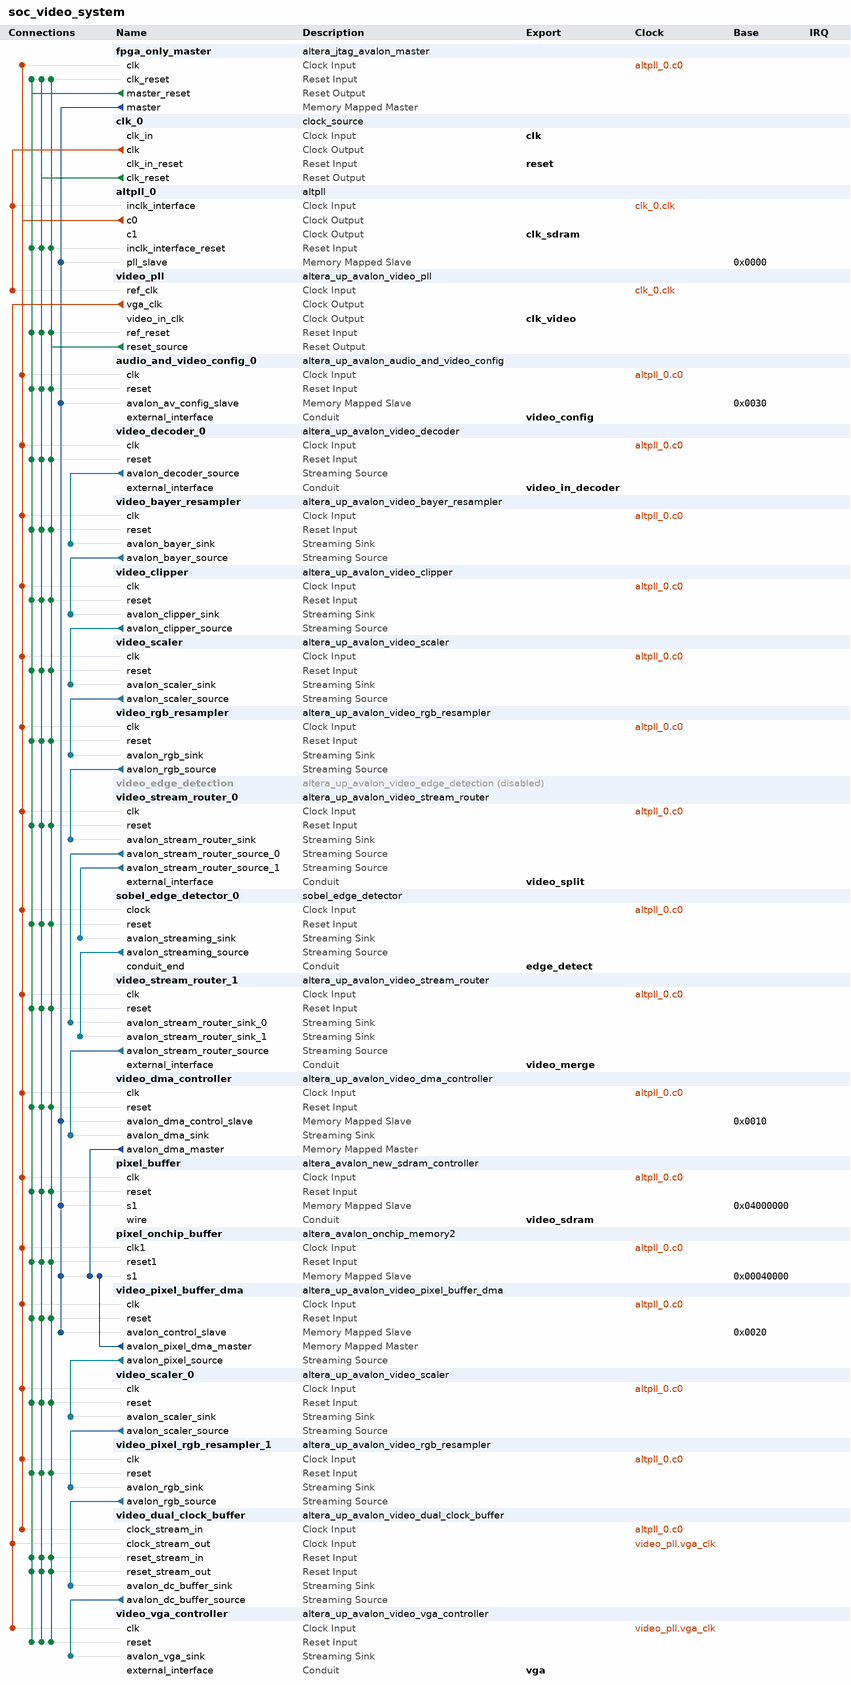
[diagram p0: system contents]
# Platform Designer (Qsys) system soc_video_system, MAX 10 10M50DAF484C6GES
# Parameters at their usual value, and those the tool derives, are not listed.
package require -exact qsys 17.1
create_system soc_video_system
set_project_property DEVICE_FAMILY {MAX 10}
set_project_property DEVICE 10M50DAF484C6GES

add_instance fpga_only_master altera_jtag_avalon_master 17.1

add_instance clk_0 clock_source 17.1
set_instance_parameter_value clk_0 clockFrequency 50000000

add_instance altpll_0 altpll 17.1
set_instance_parameter_value altpll_0 CLK0_DIVIDE_BY 1
set_instance_parameter_value altpll_0 CLK0_MULTIPLY_BY 2
set_instance_parameter_value altpll_0 CLK1_DIVIDE_BY 1
set_instance_parameter_value altpll_0 CLK1_DUTY_CYCLE 50
set_instance_parameter_value altpll_0 CLK1_MULTIPLY_BY 2
set_instance_parameter_value altpll_0 CLK1_PHASE_SHIFT -5139
set_instance_parameter_value altpll_0 INCLK0_INPUT_FREQUENCY 20000
set_instance_parameter_value altpll_0 PORT_ARESET PORT_UNUSED
set_instance_parameter_value altpll_0 PORT_LOCKED PORT_UNUSED
set_instance_parameter_value altpll_0 PORT_clk1 PORT_USED
set_instance_parameter_value altpll_0 PORT_clk2 PORT_UNUSED
set_instance_parameter_value altpll_0 PORT_clk3 PORT_UNUSED

add_instance video_pll altera_up_avalon_video_pll 17.1
set_instance_parameter_value video_pll camera {5MP Digital Camera (THDB_D5M)}
set_instance_parameter_value video_pll gui_refclk 50.0
set_instance_parameter_value video_pll lcd {2.4" LCD on LT24}
set_instance_parameter_value video_pll video_in_clk_en true

add_instance audio_and_video_config_0 altera_up_avalon_audio_and_video_config 17.1
set_instance_parameter_value audio_and_video_config_0 audio_in {Microphone to ADC}
set_instance_parameter_value audio_and_video_config_0 bit_length 24
set_instance_parameter_value audio_and_video_config_0 board DE1-SoC
set_instance_parameter_value audio_and_video_config_0 line_in_bypass false
set_instance_parameter_value audio_and_video_config_0 sampling_rate {48 kHz}

add_instance video_decoder_0 altera_up_avalon_video_decoder 17.1
set_instance_parameter_value video_decoder_0 video_source {5MP Digital Camera (THDB_D5M)}

add_instance video_bayer_resampler altera_up_avalon_video_bayer_resampler 17.1
set_instance_parameter_value video_bayer_resampler custom_height_in 1944
set_instance_parameter_value video_bayer_resampler custom_width_in 2592
set_instance_parameter_value video_bayer_resampler use_custom_format true

add_instance video_clipper altera_up_avalon_video_clipper 17.1
set_instance_parameter_value video_clipper color_bits 8
set_instance_parameter_value video_clipper color_planes 3
set_instance_parameter_value video_clipper drop_bottom 6
set_instance_parameter_value video_clipper drop_left 8
set_instance_parameter_value video_clipper drop_right 8
set_instance_parameter_value video_clipper drop_top 6
set_instance_parameter_value video_clipper height_in 972
set_instance_parameter_value video_clipper width_in 1296

add_instance video_scaler altera_up_avalon_video_scaler 17.1
set_instance_parameter_value video_scaler color_bits 8
set_instance_parameter_value video_scaler color_planes 3
set_instance_parameter_value video_scaler height_in 960
set_instance_parameter_value video_scaler height_scaling 0.25
set_instance_parameter_value video_scaler width_in 1280
set_instance_parameter_value video_scaler width_scaling 0.25

add_instance video_rgb_resampler altera_up_avalon_video_rgb_resampler 17.1
set_instance_parameter_value video_rgb_resampler alpha 1023
set_instance_parameter_value video_rgb_resampler input_type {24-bit RGB}
set_instance_parameter_value video_rgb_resampler output_type {8-bit Grayscale}

add_instance video_edge_detection altera_up_avalon_video_edge_detection 17.1
set_instance_property video_edge_detection ENABLED false
set_instance_parameter_value video_edge_detection intensity 1
set_instance_parameter_value video_edge_detection width 320

add_instance video_stream_router_0 altera_up_avalon_video_stream_router 17.1
set_instance_parameter_value video_stream_router_0 color_bits 8
set_instance_parameter_value video_stream_router_0 color_planes 1
set_instance_parameter_value video_stream_router_0 router_type Split
set_instance_parameter_value video_stream_router_0 sync false

add_instance sobel_edge_detector_0 sobel_edge_detector 1.0
set_instance_parameter_value sobel_edge_detector_0 WIDTH 320

add_instance video_stream_router_1 altera_up_avalon_video_stream_router 17.1
set_instance_parameter_value video_stream_router_1 color_bits 8
set_instance_parameter_value video_stream_router_1 color_planes 1
set_instance_parameter_value video_stream_router_1 router_type Merge
set_instance_parameter_value video_stream_router_1 sync false

add_instance video_dma_controller altera_up_avalon_video_dma_controller 17.1
set_instance_parameter_value video_dma_controller addr_mode X-Y
set_instance_parameter_value video_dma_controller back_start_address 0
set_instance_parameter_value video_dma_controller color_bits 8
set_instance_parameter_value video_dma_controller color_planes 1
set_instance_parameter_value video_dma_controller dma_enabled true
set_instance_parameter_value video_dma_controller height 240
set_instance_parameter_value video_dma_controller mode {From Stream to Memory}
set_instance_parameter_value video_dma_controller start_address 0
set_instance_parameter_value video_dma_controller width 320

add_instance pixel_buffer altera_avalon_new_sdram_controller 17.1
set_instance_parameter_value pixel_buffer TAC 5.4
set_instance_parameter_value pixel_buffer TRCD 15.0
set_instance_parameter_value pixel_buffer TRFC 75.0
set_instance_parameter_value pixel_buffer TRP 15.0
set_instance_parameter_value pixel_buffer TWR 20.0
set_instance_parameter_value pixel_buffer casLatency 3
set_instance_parameter_value pixel_buffer columnWidth 10
set_instance_parameter_value pixel_buffer dataWidth 16
set_instance_parameter_value pixel_buffer generateSimulationModel false
set_instance_parameter_value pixel_buffer model single_Micron_MT48LC4M32B2_7_chip
set_instance_parameter_value pixel_buffer numberOfBanks 4
set_instance_parameter_value pixel_buffer numberOfChipSelects 1
set_instance_parameter_value pixel_buffer powerUpDelay 100.0
set_instance_parameter_value pixel_buffer refreshPeriod 57.0
set_instance_parameter_value pixel_buffer rowWidth 13

add_instance pixel_onchip_buffer altera_avalon_onchip_memory2 17.1
set_instance_parameter_value pixel_onchip_buffer dataWidth 8
set_instance_parameter_value pixel_onchip_buffer dualPort false
set_instance_parameter_value pixel_onchip_buffer initMemContent false
set_instance_parameter_value pixel_onchip_buffer initializationFileName onchip_mem.hex
set_instance_parameter_value pixel_onchip_buffer memorySize 153600
set_instance_parameter_value pixel_onchip_buffer resetrequest_enabled false

add_instance video_pixel_buffer_dma altera_up_avalon_video_pixel_buffer_dma 17.1
set_instance_parameter_value video_pixel_buffer_dma addr_mode X-Y
set_instance_parameter_value video_pixel_buffer_dma back_start_address 0
set_instance_parameter_value video_pixel_buffer_dma color_space {8-bit Grayscale}
set_instance_parameter_value video_pixel_buffer_dma image_height 240
set_instance_parameter_value video_pixel_buffer_dma image_width 320
set_instance_parameter_value video_pixel_buffer_dma start_address 0

add_instance video_scaler_0 altera_up_avalon_video_scaler 17.1
set_instance_parameter_value video_scaler_0 color_bits 8
set_instance_parameter_value video_scaler_0 color_planes 1
set_instance_parameter_value video_scaler_0 height_scaling 2
set_instance_parameter_value video_scaler_0 width_in 320
set_instance_parameter_value video_scaler_0 width_scaling 2

add_instance video_pixel_rgb_resampler_1 altera_up_avalon_video_rgb_resampler 17.1
set_instance_parameter_value video_pixel_rgb_resampler_1 alpha 1023
set_instance_parameter_value video_pixel_rgb_resampler_1 input_type {8-bit Grayscale}
set_instance_parameter_value video_pixel_rgb_resampler_1 output_type {30-bit RGB}

add_instance video_dual_clock_buffer altera_up_avalon_video_dual_clock_buffer 17.1
set_instance_parameter_value video_dual_clock_buffer color_bits 10

add_instance video_vga_controller altera_up_avalon_video_vga_controller 17.1
set_instance_parameter_value video_vga_controller board DE1-SoC
set_instance_parameter_value video_vga_controller resolution {VGA 640x480}

# connections
add_connection altpll_0.c0 audio_and_video_config_0.clk clock
add_connection altpll_0.c0 fpga_only_master.clk clock
add_connection altpll_0.c0 pixel_buffer.clk clock
add_connection altpll_0.c0 pixel_onchip_buffer.clk1 clock
add_connection altpll_0.c0 sobel_edge_detector_0.clock clock
add_connection altpll_0.c0 video_bayer_resampler.clk clock
add_connection altpll_0.c0 video_clipper.clk clock
add_connection altpll_0.c0 video_decoder_0.clk clock
add_connection altpll_0.c0 video_dma_controller.clk clock
add_connection altpll_0.c0 video_dual_clock_buffer.clock_stream_in clock
add_connection altpll_0.c0 video_pixel_buffer_dma.clk clock
add_connection altpll_0.c0 video_pixel_rgb_resampler_1.clk clock
add_connection altpll_0.c0 video_rgb_resampler.clk clock
add_connection altpll_0.c0 video_scaler.clk clock
add_connection altpll_0.c0 video_scaler_0.clk clock
add_connection altpll_0.c0 video_stream_router_0.clk clock
add_connection altpll_0.c0 video_stream_router_1.clk clock
add_connection clk_0.clk altpll_0.inclk_interface clock
add_connection clk_0.clk video_pll.ref_clk clock
add_connection video_pll.vga_clk video_dual_clock_buffer.clock_stream_out clock
add_connection video_pll.vga_clk video_vga_controller.clk clock
add_connection clk_0.clk_reset altpll_0.inclk_interface_reset reset
add_connection clk_0.clk_reset audio_and_video_config_0.reset reset
add_connection clk_0.clk_reset fpga_only_master.clk_reset reset
add_connection clk_0.clk_reset pixel_buffer.reset reset
add_connection clk_0.clk_reset pixel_onchip_buffer.reset1 reset
add_connection clk_0.clk_reset sobel_edge_detector_0.reset reset
add_connection clk_0.clk_reset video_bayer_resampler.reset reset
add_connection clk_0.clk_reset video_clipper.reset reset
add_connection clk_0.clk_reset video_decoder_0.reset reset
add_connection clk_0.clk_reset video_dma_controller.reset reset
add_connection clk_0.clk_reset video_dual_clock_buffer.reset_stream_in reset
add_connection clk_0.clk_reset video_dual_clock_buffer.reset_stream_out reset
add_connection clk_0.clk_reset video_pixel_buffer_dma.reset reset
add_connection clk_0.clk_reset video_pixel_rgb_resampler_1.reset reset
add_connection clk_0.clk_reset video_pll.ref_reset reset
add_connection clk_0.clk_reset video_rgb_resampler.reset reset
add_connection clk_0.clk_reset video_scaler.reset reset
add_connection clk_0.clk_reset video_scaler_0.reset reset
add_connection clk_0.clk_reset video_stream_router_0.reset reset
add_connection clk_0.clk_reset video_stream_router_1.reset reset
add_connection clk_0.clk_reset video_vga_controller.reset reset
add_connection fpga_only_master.master_reset altpll_0.inclk_interface_reset reset
add_connection fpga_only_master.master_reset audio_and_video_config_0.reset reset
add_connection fpga_only_master.master_reset fpga_only_master.clk_reset reset
add_connection fpga_only_master.master_reset pixel_buffer.reset reset
add_connection fpga_only_master.master_reset pixel_onchip_buffer.reset1 reset
add_connection fpga_only_master.master_reset sobel_edge_detector_0.reset reset
add_connection fpga_only_master.master_reset video_bayer_resampler.reset reset
add_connection fpga_only_master.master_reset video_clipper.reset reset
add_connection fpga_only_master.master_reset video_decoder_0.reset reset
add_connection fpga_only_master.master_reset video_dma_controller.reset reset
add_connection fpga_only_master.master_reset video_dual_clock_buffer.reset_stream_in reset
add_connection fpga_only_master.master_reset video_dual_clock_buffer.reset_stream_out reset
add_connection fpga_only_master.master_reset video_pixel_buffer_dma.reset reset
add_connection fpga_only_master.master_reset video_pixel_rgb_resampler_1.reset reset
add_connection fpga_only_master.master_reset video_pll.ref_reset reset
add_connection fpga_only_master.master_reset video_rgb_resampler.reset reset
add_connection fpga_only_master.master_reset video_scaler.reset reset
add_connection fpga_only_master.master_reset video_scaler_0.reset reset
add_connection fpga_only_master.master_reset video_stream_router_0.reset reset
add_connection fpga_only_master.master_reset video_stream_router_1.reset reset
add_connection fpga_only_master.master_reset video_vga_controller.reset reset
add_connection video_pll.reset_source altpll_0.inclk_interface_reset reset
add_connection video_pll.reset_source audio_and_video_config_0.reset reset
add_connection video_pll.reset_source fpga_only_master.clk_reset reset
add_connection video_pll.reset_source pixel_buffer.reset reset
add_connection video_pll.reset_source pixel_onchip_buffer.reset1 reset
add_connection video_pll.reset_source sobel_edge_detector_0.reset reset
add_connection video_pll.reset_source video_bayer_resampler.reset reset
add_connection video_pll.reset_source video_clipper.reset reset
add_connection video_pll.reset_source video_decoder_0.reset reset
add_connection video_pll.reset_source video_dma_controller.reset reset
add_connection video_pll.reset_source video_dual_clock_buffer.reset_stream_in reset
add_connection video_pll.reset_source video_dual_clock_buffer.reset_stream_out reset
add_connection video_pll.reset_source video_pixel_buffer_dma.reset reset
add_connection video_pll.reset_source video_pixel_rgb_resampler_1.reset reset
add_connection video_pll.reset_source video_pll.ref_reset reset
add_connection video_pll.reset_source video_rgb_resampler.reset reset
add_connection video_pll.reset_source video_scaler.reset reset
add_connection video_pll.reset_source video_scaler_0.reset reset
add_connection video_pll.reset_source video_stream_router_0.reset reset
add_connection video_pll.reset_source video_stream_router_1.reset reset
add_connection video_pll.reset_source video_vga_controller.reset reset
add_connection fpga_only_master.master altpll_0.pll_slave avalon
set_connection_parameter_value fpga_only_master.master/altpll_0.pll_slave baseAddress 0x0000
add_connection fpga_only_master.master audio_and_video_config_0.avalon_av_config_slave avalon
set_connection_parameter_value fpga_only_master.master/audio_and_video_config_0.avalon_av_config_slave baseAddress 0x0030
add_connection fpga_only_master.master pixel_buffer.s1 avalon
set_connection_parameter_value fpga_only_master.master/pixel_buffer.s1 baseAddress 0x04000000
add_connection fpga_only_master.master pixel_onchip_buffer.s1 avalon
set_connection_parameter_value fpga_only_master.master/pixel_onchip_buffer.s1 baseAddress 0x00040000
add_connection fpga_only_master.master video_dma_controller.avalon_dma_control_slave avalon
set_connection_parameter_value fpga_only_master.master/video_dma_controller.avalon_dma_control_slave baseAddress 0x0010
add_connection fpga_only_master.master video_pixel_buffer_dma.avalon_control_slave avalon
set_connection_parameter_value fpga_only_master.master/video_pixel_buffer_dma.avalon_control_slave baseAddress 0x0020
add_connection video_dma_controller.avalon_dma_master pixel_onchip_buffer.s1 avalon
set_connection_parameter_value video_dma_controller.avalon_dma_master/pixel_onchip_buffer.s1 baseAddress 0x00040000
add_connection video_pixel_buffer_dma.avalon_pixel_dma_master pixel_onchip_buffer.s1 avalon
set_connection_parameter_value video_pixel_buffer_dma.avalon_pixel_dma_master/pixel_onchip_buffer.s1 baseAddress 0x00040000
add_connection sobel_edge_detector_0.avalon_streaming_source video_stream_router_1.avalon_stream_router_sink_1 avalon_streaming
add_connection video_bayer_resampler.avalon_bayer_source video_clipper.avalon_clipper_sink avalon_streaming
add_connection video_clipper.avalon_clipper_source video_scaler.avalon_scaler_sink avalon_streaming
add_connection video_decoder_0.avalon_decoder_source video_bayer_resampler.avalon_bayer_sink avalon_streaming
add_connection video_dual_clock_buffer.avalon_dc_buffer_source video_vga_controller.avalon_vga_sink avalon_streaming
add_connection video_pixel_buffer_dma.avalon_pixel_source video_scaler_0.avalon_scaler_sink avalon_streaming
add_connection video_pixel_rgb_resampler_1.avalon_rgb_source video_dual_clock_buffer.avalon_dc_buffer_sink avalon_streaming
add_connection video_rgb_resampler.avalon_rgb_source video_stream_router_0.avalon_stream_router_sink avalon_streaming
add_connection video_scaler.avalon_scaler_source video_rgb_resampler.avalon_rgb_sink avalon_streaming
add_connection video_scaler_0.avalon_scaler_source video_pixel_rgb_resampler_1.avalon_rgb_sink avalon_streaming
add_connection video_stream_router_0.avalon_stream_router_source_0 video_stream_router_1.avalon_stream_router_sink_0 avalon_streaming
add_connection video_stream_router_0.avalon_stream_router_source_1 sobel_edge_detector_0.avalon_streaming_sink avalon_streaming
add_connection video_stream_router_1.avalon_stream_router_source video_dma_controller.avalon_dma_sink avalon_streaming

# exported interfaces
add_interface clk clock sink
set_interface_property clk EXPORT_OF clk_0.clk_in
add_interface clk_sdram clock source
set_interface_property clk_sdram EXPORT_OF altpll_0.c1
add_interface clk_video clock source
set_interface_property clk_video EXPORT_OF video_pll.video_in_clk
add_interface edge_detect conduit end
set_interface_property edge_detect EXPORT_OF sobel_edge_detector_0.conduit_end
add_interface reset reset sink
set_interface_property reset EXPORT_OF clk_0.clk_in_reset
add_interface vga conduit end
set_interface_property vga EXPORT_OF video_vga_controller.external_interface
add_interface video_config conduit end
set_interface_property video_config EXPORT_OF audio_and_video_config_0.external_interface
add_interface video_in_decoder conduit end
set_interface_property video_in_decoder EXPORT_OF video_decoder_0.external_interface
add_interface video_merge conduit end
set_interface_property video_merge EXPORT_OF video_stream_router_1.external_interface
add_interface video_sdram conduit end
set_interface_property video_sdram EXPORT_OF pixel_buffer.wire
add_interface video_split conduit end
set_interface_property video_split EXPORT_OF video_stream_router_0.external_interface

set_interconnect_requirement {$system} qsys_mm.clockCrossingAdapter HANDSHAKE
set_interconnect_requirement {$system} qsys_mm.maxAdditionalLatency 1

save_system soc_video_system.qsys
